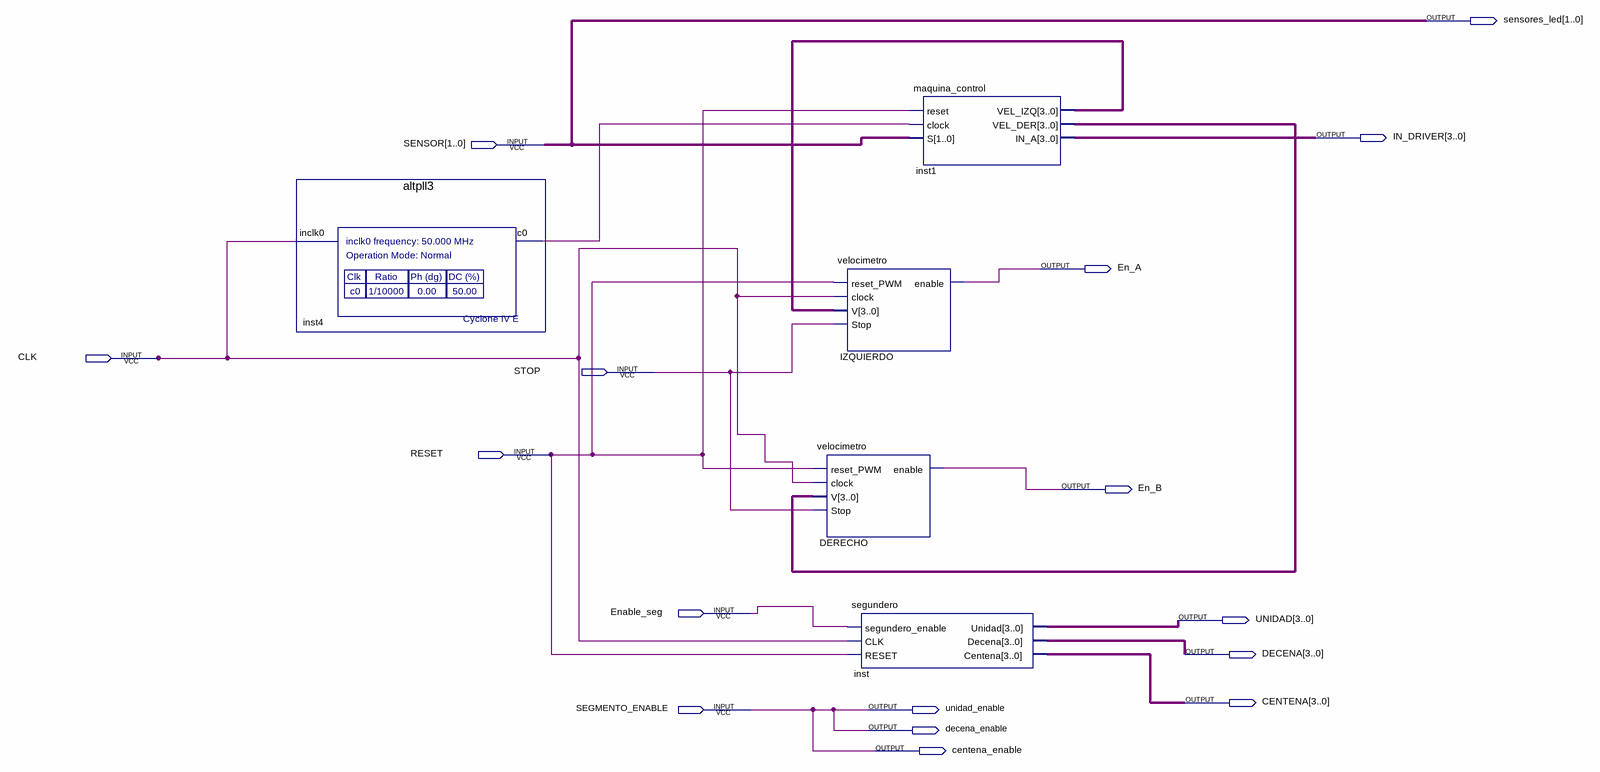
[diagram p0: schematic sheet]
// Quartus schematic autito_principal.bdf as structural Verilog: 5 symbols, 16 pins
module autito_principal (
  input  [1:0] SENSOR,
  input  CLK,
  input  STOP,
  input  RESET,
  input  Enable_seg,
  input  SEGMENTO_ENABLE,
  output [1:0] sensores_led,
  output [3:0] IN_DRIVER,
  output En_A,
  output En_B,
  output [3:0] UNIDAD,
  output [3:0] DECENA,
  output [3:0] CENTENA,
  output unidad_enable,
  output decena_enable,
  output centena_enable
);

  wire inst4_c0;
  wire [3:0] inst1_vel_der, inst1_vel_izq;

  altpll3 inst4 (.inclk0(CLK), .c0(inst4_c0));
  velocimetro IZQUIERDO (.reset_PWM(RESET), .clock(CLK), .V(inst1_vel_izq), .Stop(STOP), .enable(En_A));
  velocimetro DERECHO (.reset_PWM(RESET), .clock(CLK), .V(inst1_vel_der), .Stop(STOP), .enable(En_B));
  segundero inst (
    .segundero_enable(Enable_seg), .CLK(CLK), .RESET(RESET), .Unidad(UNIDAD), .Decena(DECENA),
    .Centena(CENTENA));
  maquina_control inst1 (
    .reset(RESET), .clock(inst4_c0), .S(SENSOR), .VEL_IZQ(inst1_vel_izq), .VEL_DER(inst1_vel_der),
    .IN_A(IN_DRIVER));

  assign centena_enable = SEGMENTO_ENABLE;
  assign decena_enable = SEGMENTO_ENABLE;
  assign sensores_led = SENSOR;
  assign unidad_enable = SEGMENTO_ENABLE;
endmodule
